# EAGLE design uebung1 (EAGLE 7.4.0)
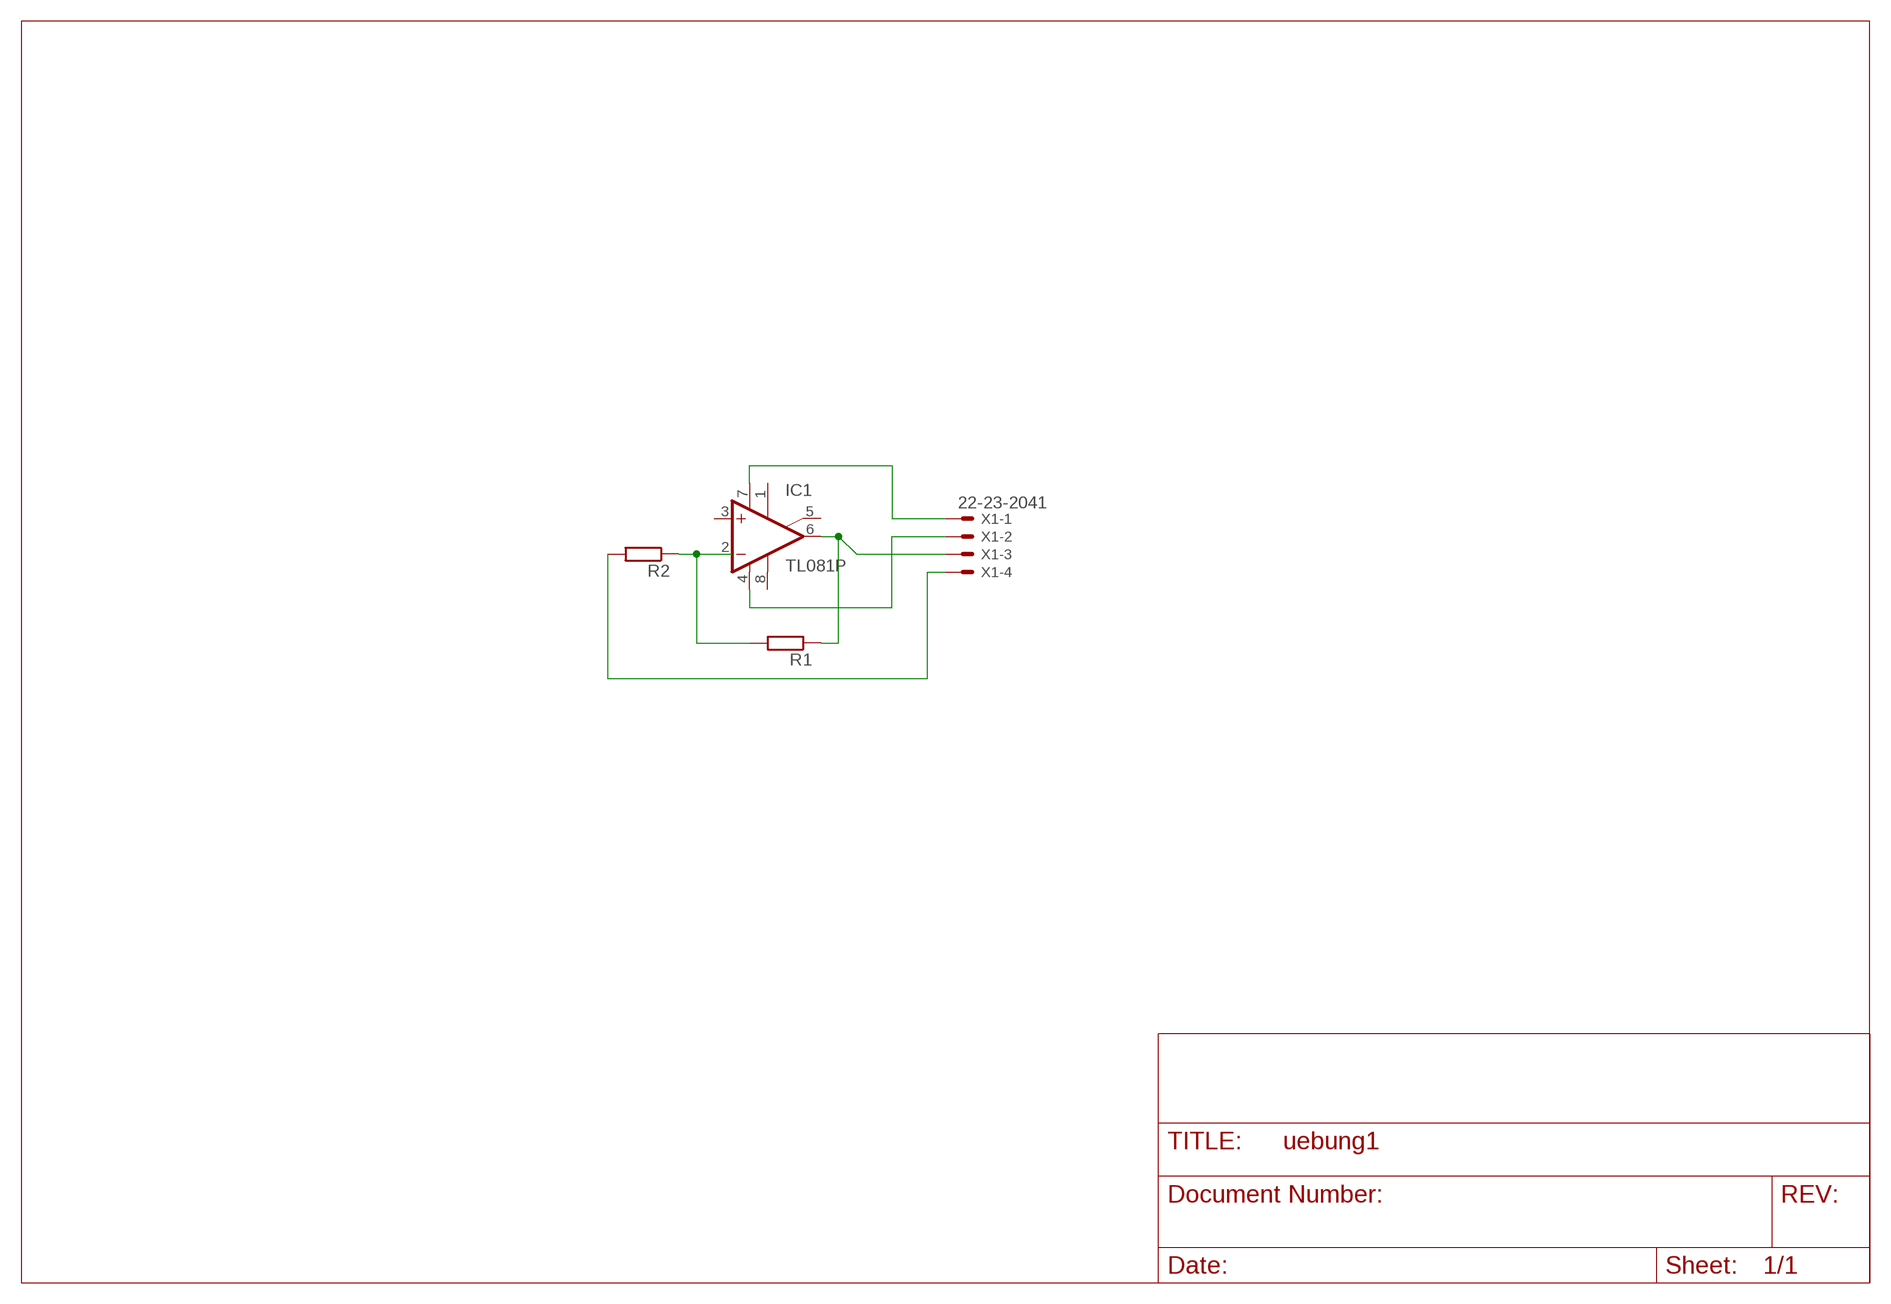
[diagram p0: schematic, sheet 1]

## Parts
IC1  TL081P  [DIL08]
R1  R-EU_0207/10  [0207/10]
R2  R-EU_0207/10  [0207/10]
X1  22-23-2041  [22-23-2041]

## Nets
N$1: R1.2 R2.1
N$2: IC1.6(OUT) R1.1 X1.3
N$3: R2.2 X1.4
N$4: IC1.4(V-) X1.2
N$5: IC1.7(V+) X1.1
Unconnected: IC1.1(ON1) IC1.2(-IN) IC1.3(+IN) IC1.5(ON2) IC1.8(OPT)

## Library data of the parts
IC1 = linear:TL081: OP AMP
R1 R2 = rcl:R-EU_: RESISTOR, European symbol
X1 = con-molex:22-23-2041: .100" (2.54mm) Center Header - 4 Pin; MF: MOLEX; MPN: 22-23-2041; OC_FARNELL: 1462920; OC_NEWARK: 38C0355

## Board
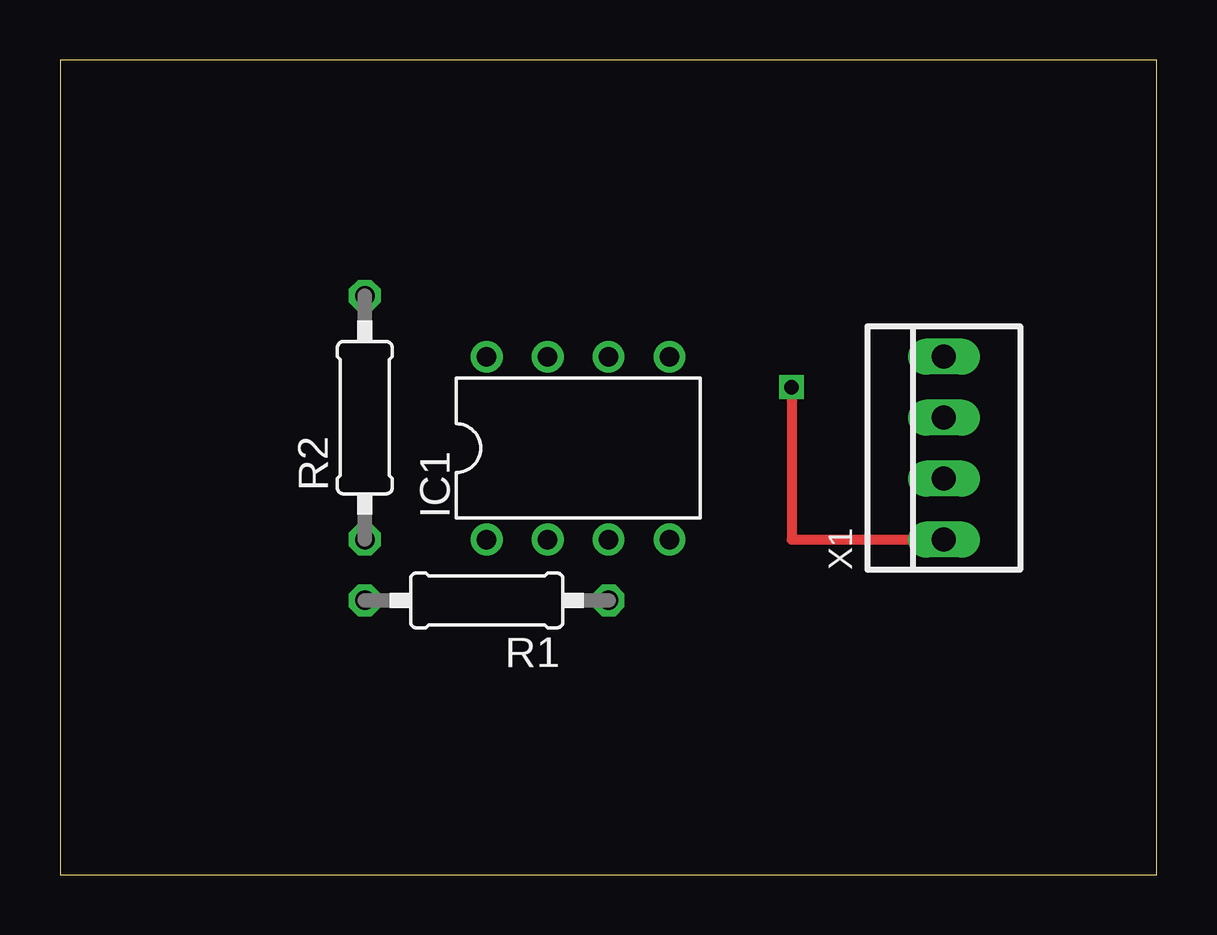
[diagram p1: board, top side]
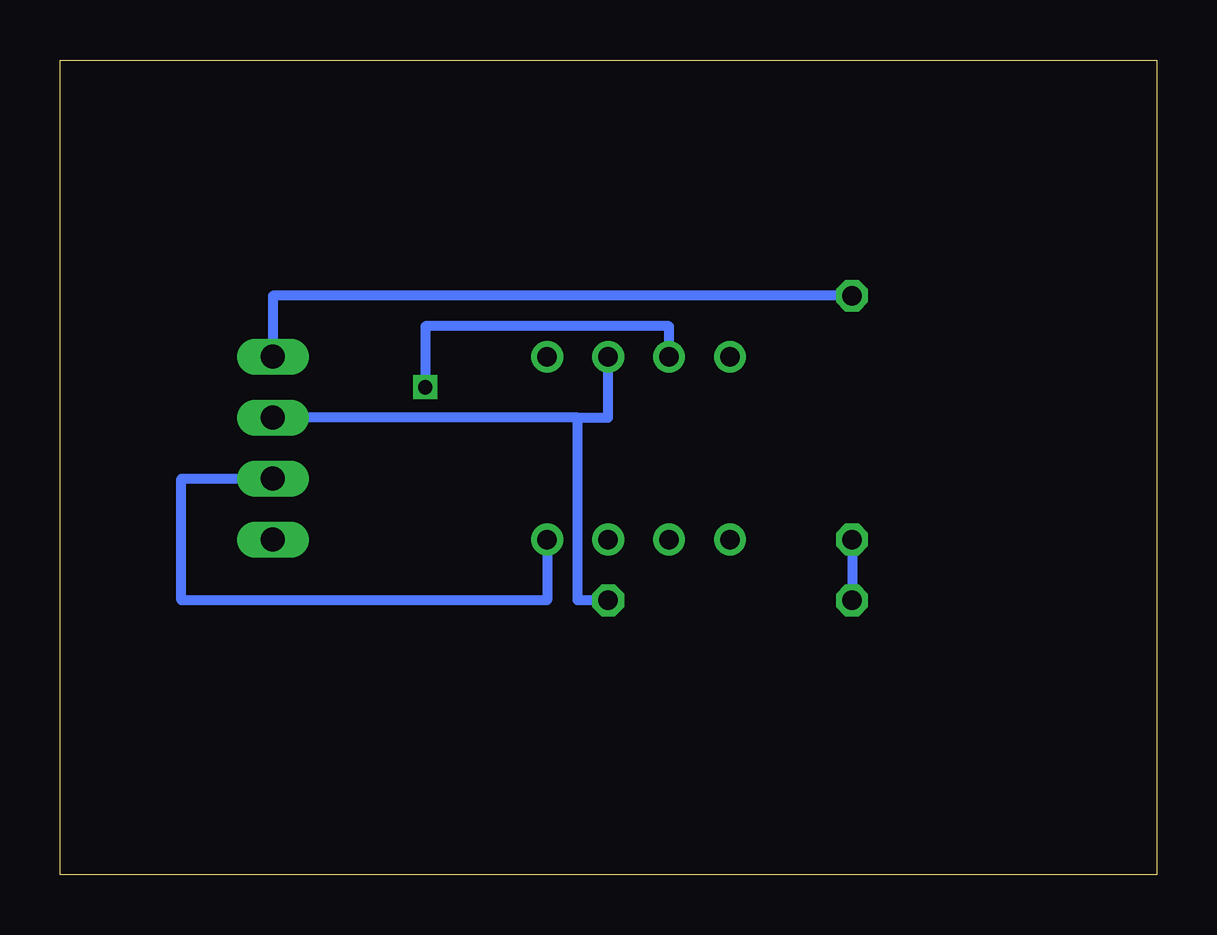
[diagram p2: board, bottom side, seen from below]

Size 45.7 x 33.96 mm. Coordinates in mm from the lower left corner, seen from the top.
Outline: 0,0 45.7,0 45.7,33.96 0,33.96 0,0
Copper layers (1*16): Top 0.035mm / dielectric 1.5mm / Bottom 0.035mm
Design rules "default": minimum track width 10mil, minimum drill 24mil, track to track 8mil, track to pad 8mil, pad to pad 8mil, via to via 8mil, smd to smd 8mil, copper to edge 40mil, drill to drill 8mil, minimum pad ring 10mil, minimum via ring 8mil, stop-mask expansion 4mil, vias tented up to drill 0mil, thermal gap 10mil

### Footprints (pad centres in the part's own frame; a part is rotated, then mirrored left to right if it is on the bottom)
DIL08 = drill 0.813 pad 1.27: 1 -3.81,-3.81; 2 -1.27,-3.81; 3 1.27,-3.81; 4 3.81,-3.81; 5 3.81,3.81; 6 1.27,3.81; 7 -1.27,3.81; 8 -3.81,3.81
0207/10 = drill 0.813 octagon: 1 -5.08,0; 2 5.08,0
22-23-2041 = drill 1 long: 1 -3.81,0; 2 -1.27,0; 3 1.27,0; 4 3.81,0

### Placement (x,y rotation side)
IC1  21.59,17.78 0 top
R1  17.78,11.43 180 top
R2  12.7,19.05 90 top
X1  36.83,17.78 90 top

### Tracks (layer width: path | path; a pad name or v marks a point on that pad's centre or on a via)
N$1
  Bottom 0.406: R2.1 R1.2
N$2
  Bottom 0.406: 24.13,19.05 X1.3 | R1.1 24.13,11.43 24.13,19.05 | 24.13,19.05 22.86,19.05 IC1.6
N$3
  Bottom 0.406: R2.2 36.83,24.13 X1.4
N$4
  Bottom 0.406: IC1.4 25.4,11.43 40.64,11.43 40.64,16.51 X1.2
N$5  (via drill 0.6)
  Top 0.406: v30.48,20.32 30.48,13.97 X1.1
  Bottom 0.406: IC1.7 20.32,22.86 30.48,22.86 v30.48,20.32